# Altium schematic sheet Sheet.SchDoc
size A4
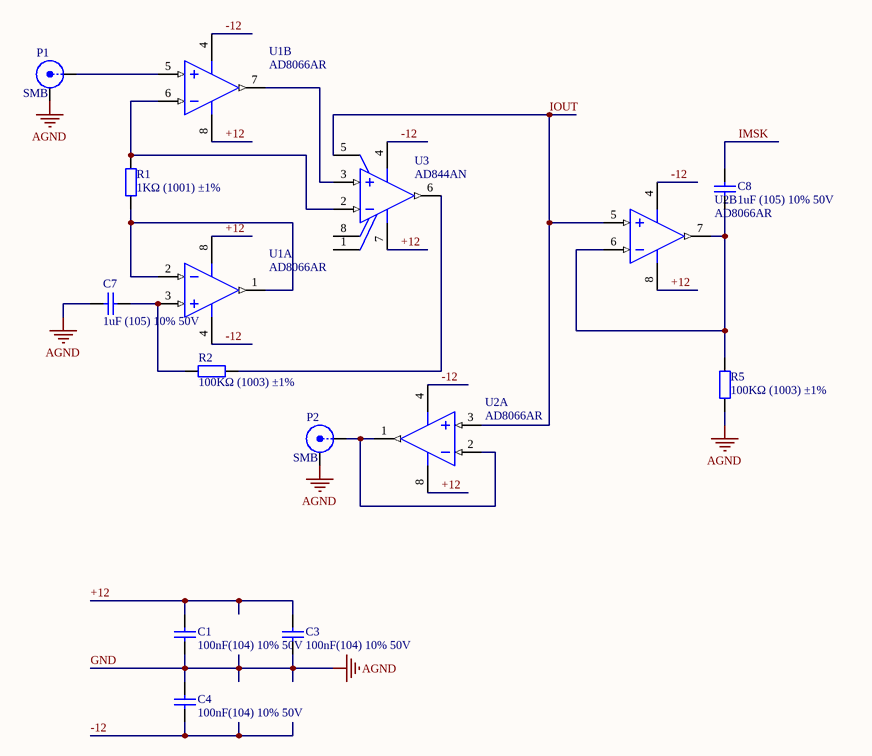
[diagram p0: Sheet.SchDoc]

## Parts
C1  100nF(104) 10% 50V  [LC-0805_C]
C3  100nF(104) 10% 50V  [LC-0805_C]
C4  100nF(104) 10% 50V  [LC-0805_C]
C7  1uF (105) 10% 50V  [LC-0805_C]
C8  1uF (105) 10% 50V  [LC-0805_C]
P1  SMB  [SMB_V-RJ45]
P2  SMB  [SMB_V-RJ45]
R1  1KΩ (1001) ±1%  [LC-0805_R]
R2  100KΩ (1003) ±1%  [LC-0805_R]
R5  100KΩ (1003) ±1%  [LC-0805_R]
U1  AD8066AR  [ADI-R-8_N]  (parts A,B of 2)
U2  AD8066AR  [ADI-R-8_N]  (parts A,B of 2)
U3  AD844AN  [ADI-N-8]

## Nets
GND: C1.1 C3.1 C4.2 C7.1 P1.2(Y) P2.2(Y) R5.1  [also labelled AGND]
+12: C1.2 C3.2 U1.8(+VS) U2.8(+VS) U3.7(+VS)
-12: C4.1 U1.4(-VS) U2.4(-VS) U3.4(-VS)
IMSK: C8.2
IOUT: U2.3(+IN_1) U2.5(+IN_2) U3.5(TZ)
NetC7_2: C7.2 R2.1 U1.3(+IN_1)
NetC8_1: C8.1 R5.2 U2.6(-IN_2) U2.7(VOUT_2)
NetP1_1: P1.1(X) U1.5(+IN_2)
NetP2_1: P2.1(X) U2.1(VOUT_1) U2.2(-IN_1)
NetR1_1: R1.1 U1.1(VOUT_1) U1.2(-IN_1)
NetR1_2: R1.2 U1.6(-IN_2) U3.2(-IN)
NetR2_2: R2.2 U3.6(OUTPUT)
NetU1_7: U1.7(VOUT_2) U3.3(+IN)

Not connected (* = marked no-connect by the designer): U3 1(NULL) 8(NULL)

## Library data of the parts
C1 C3 C4 = 0805 100nF(104) 10% 50V: 贴片电容; ComponentLink1Description: 供应商链接; ComponentLink1URL: http://www.szlcsc.com/product/details_50686.html; Package: 0805; Supplier: LC; SuppliersPartNumber: C49678
C7 C8 = 0805 1uF (105) 10% 50V: 贴片电容; ComponentLink1Description: 供应商链接; ComponentLink1URL: http://www.szlcsc.com/product/details_29074.html; Package: 0805; Supplier: LC; SuppliersPartNumber: C28323
P1 P2 = SMB: SMB Straight Connector; LatestRevisionDate: 17-Jul-2002; LatestRevisionNote: Re-released for DXP Platform.; Publisher: Altium Limited
R1 = 0805 1KΩ (1001) 1%: 贴片电阻; ComponentLink1Description: 供应商链接; ComponentLink1URL: http://www.szlcsc.com/product/details_18201.html; Package: 0805; Supplier: LC; SuppliersPartNumber: C17513
R2 R5 = 0805 100KΩ (1003) 1%: 贴片电阻; ComponentLink1Description: 供应商链接; ComponentLink1URL: http://www.szlcsc.com/product/details_18095.html; Package: 0805; Supplier: LC; SuppliersPartNumber: C17407
U1 U2 = AD8066AR: Double Channel Low Power Operational Amplifier, 145 MHz BW, 180 V/us SR, Industrial, 8-pin SOIC (R-8), Tube; Generic Part Number: AD8066; Manufacturer: Analog Devices; Amplifiers Per Package: 2; Input Bias Current: 2pA; Input Offset Voltage: 400uV; Iq/Amp: 7.4mA; Small Signal Bandwidth: 145MHz; V Span Max: 24V; V Span Min: 5V; DatasheetVersion: Rev. J; PackageVersion: 060506-A; PackageReference: R-8; PackageDescription: 8-Pin Standard Small Outline Package, Body 3.9 x 4.9 mm, Pitch 1.27 mm; Supplier 1: Digi-Key; Supplier Part Number 1: AD8066AR-ND; Slew Rate: 180V/us; Mounting Technology: Surface Mount; Code_JEDEC: MS-012-AA; PartNumber: AD8066AR; ComponentLink1Description: Manufacturer URL; ComponentLink1URL: http://www.analog.com/en/index.html; ComponentLink2Description: Datasheet; ComponentLink2URL: http://www.analog.com/static/imported-files/data_sheets/AD8065_8066.pdf; ComponentLink3Description: Package Specification; ComponentLink3URL: http://www.analog.com/static/imported-files/packages/PKG_PDF/SOIC_Narrow%20(R)/R_8.pdf; ComponentLink4Description: Reference Circuit; ComponentLink4URL: http://www.analog.com/en/all-operational-amplifiers-op-amps/operational-amplifiers-op-amps/ad8066/products/product.html#product-recommendations
U3 = AD844AN: Single Channel Wide Bandwidth Operational Amplifier, 60 MHz BW, 2 KV/us SR, Industrial, 8-pin DIP (N-8), Tube; Generic Part Number: AD844; Manufacturer: Analog Devices; Amplifiers Per Package: 1; Input Bias Current: 150nA; Input Offset Voltage: 50uV; Iq/Amp: 6.5mA; Slew Rate: 2KV/us; Small Signal Bandwidth: 60MHz; V Span Max: 36V; V Span Min: 9V; DatasheetVersion: Rev. F; PackageVersion: 070606-A; PackageReference: N-8; PackageDescription: 8-Pin Plastic Dual In-Line Package, Row spacing 7.62 mm, Pitch 2.54 mm; Supplier 1: Digi-Key; Supplier Part Number 1: AD844AN-ND; Packing: Tube; Mounting Technology: Through Hole; Code_JEDEC: MS-001; PartNumber: AD844AN; ComponentLink1Description: Manufacturer URL; ComponentLink1URL: http://www.analog.com/en/index.html; ComponentLink2Description: Datasheet; ComponentLink2URL: http://www.analog.com/static/imported-files/data_sheets/AD844.pdf; ComponentLink3Description: Package Specification; ComponentLink3URL: http:/www.analog.com/static/imported-files/packages/PKG_PDF/PDIP(N)/N_8.pdf